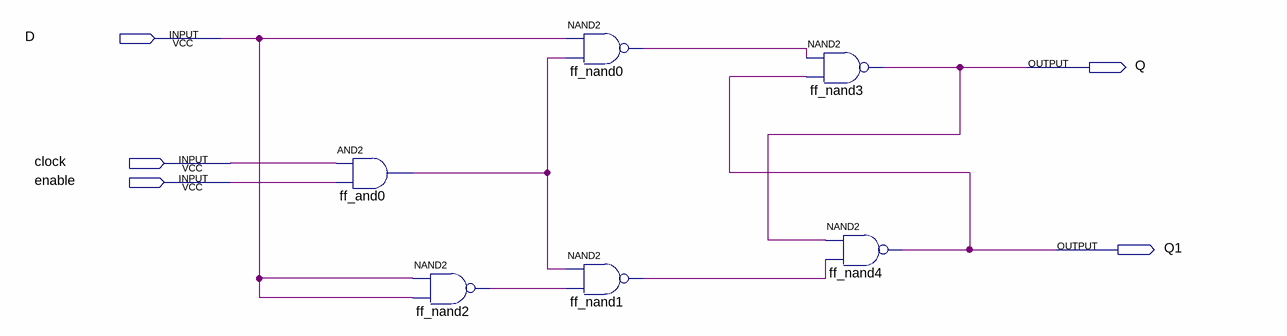
[diagram p0: schematic sheet]
// Quartus schematic flipflopD.bdf as structural Verilog: 6 symbols, 5 pins
module flipflopD (
  input  D,
  input  clock,
  input  enable,
  output Q,
  output Q1
);

  wire ff_and0_out, ff_nand0_out, ff_nand1_out, ff_nand2_out;

  and ff_and0 (ff_and0_out, clock, enable);
  nand ff_nand2 (ff_nand2_out, D, D);
  nand ff_nand0 (ff_nand0_out, D, ff_and0_out);
  nand ff_nand1 (ff_nand1_out, ff_and0_out, ff_nand2_out);
  nand ff_nand3 (Q, ff_nand0_out, Q1);
  nand ff_nand4 (Q1, Q, ff_nand1_out);
endmodule
